# Altium project _autosave-untitled.PrjPcb
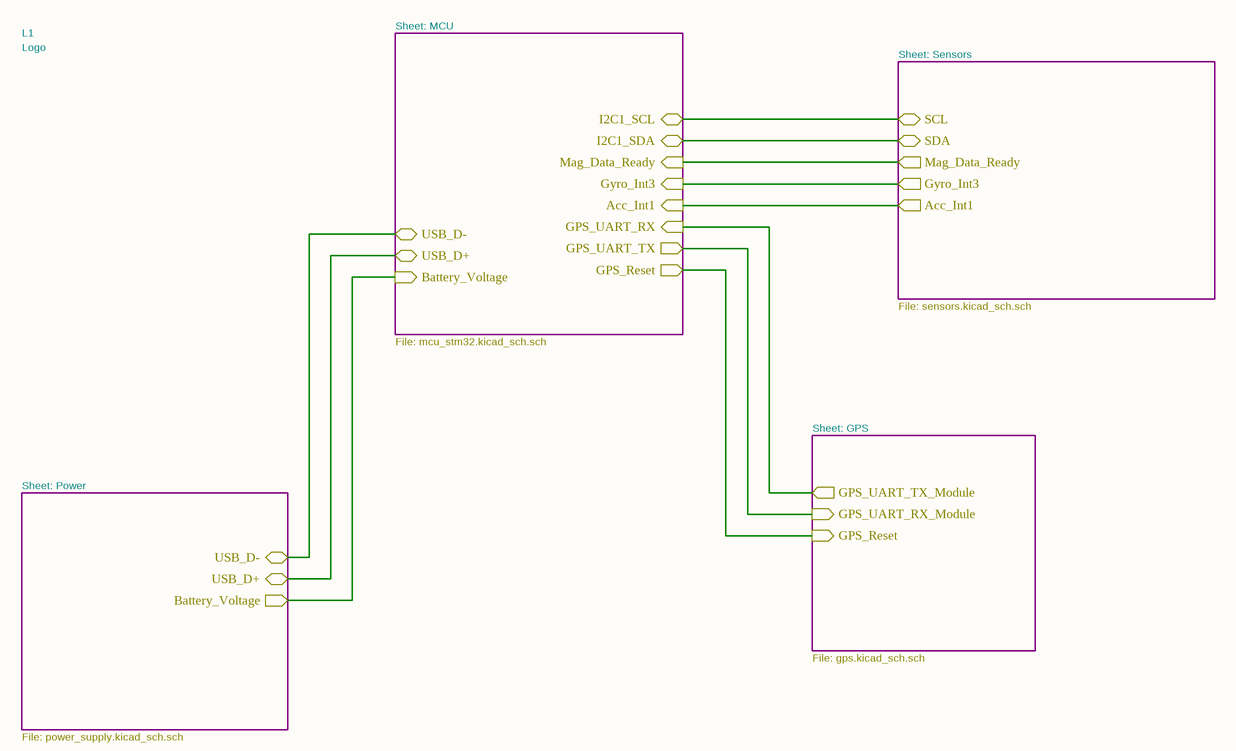
[diagram p0: circuit board design v2.1.SchDoc]
8 sheets, 72 parts. Net scope: hierarchical (ports join the sheet entries above them; power ports are global).
Board files: circuit board design v2.1.PcbDoc, circuit board design v2.1(1).PcbDoc
Sheets:
  _autosave-untitled.SchDoc
  circuit board design v2.1.SchDoc
    Sensors = sensors.SchDoc
    Power = power_supply.SchDoc
    GPS = gps.SchDoc
    MCU = mcu_stm32.SchDoc
  gps_ublox.SchDoc
  imu.SchDoc

## Sheet _autosave-untitled.SchDoc
size 297 x 209 mm

### Notes on the sheet
- 1
- 2
- 3
- 4
- 5
- 6
- A
- B
- C
- D
- Title:
- File: _autosave-untitled.kicad_sch
- Sheet: /
- KiCad E.D.A.  kicad (5.1.4)-1
- Size: A4
- Date:
- Rev:
- Id: 1/1

## Sheet circuit board design v2.1.SchDoc
size 297 x 209 mm

### Parts
L1  Logo  [ICSS_Logo]

### Sub-sheets
GPS = gps.SchDoc: GPS_Reset (in), GPS_UART_TX_Module (out), GPS_UART_RX_Module (in)
MCU = mcu_stm32.SchDoc: Battery_Voltage (in), GPS_UART_RX (in), GPS_UART_TX (out), GPS_Reset (out), USB_D- (bidir), USB_D+ (bidir), I2C1_SDA (bidir), I2C1_SCL (bidir), Acc_Int1 (in), Gyro_Int3 (in), Mag_Data_Ready (in)
Power = power_supply.SchDoc: Battery_Voltage (out), USB_D+ (bidir), USB_D- (bidir)
Sensors = sensors.SchDoc: SCL (bidir), SDA (bidir), Mag_Data_Ready (out), Acc_Int1 (out), Gyro_Int3 (out)

### Nets
Acc_Int1: sheet Sensors/Acc_Int1, sheet MCU/Acc_Int1
Battery_Voltage: sheet Power/Battery_Voltage, sheet MCU/Battery_Voltage
GPS_Reset: sheet GPS/GPS_Reset, sheet MCU/GPS_Reset
GPS_UART_RX: sheet GPS/GPS_UART_TX_Module, sheet MCU/GPS_UART_RX
GPS_UART_RX_Module: sheet GPS/GPS_UART_RX_Module, sheet MCU/GPS_UART_TX
Gyro_Int3: sheet Sensors/Gyro_Int3, sheet MCU/Gyro_Int3
I2C1_SCL: sheet Sensors/SCL, sheet MCU/I2C1_SCL
I2C1_SDA: sheet Sensors/SDA, sheet MCU/I2C1_SDA
Mag_Data_Ready: sheet Sensors/Mag_Data_Ready, sheet MCU/Mag_Data_Ready
USB_D+: sheet Power/USB_D+, sheet MCU/USB_D+
USB_D-: sheet Power/USB_D-, sheet MCU/USB_D-

### Notes on the sheet
- Sheet: MCU
- Sheet: Sensors
- File: mcu_stm32.kicad_sch.sch
- File: sensors.kicad_sch.sch
- Sheet: Power
- Sheet: GPS
- File: gps.kicad_sch.sch
- File: power_supply.kicad_sch.sch
- 1
- 2
- 3
- 4
- 5
- 6
- A
- B
- C
- D
- Title:
- File: circuit board design v2.1.kicad_sch
- Sheet: /
- KiCad E.D.A.  kicad (5.1.4)-1
- Size: A4
- Date:
- Rev:
- Id: 1/1

### Library data of the parts
L1 = Logo: Value: Logo; Footprint: Components:ICSS_Logo

## Sheet sensors.SchDoc
size 297 x 209 mm
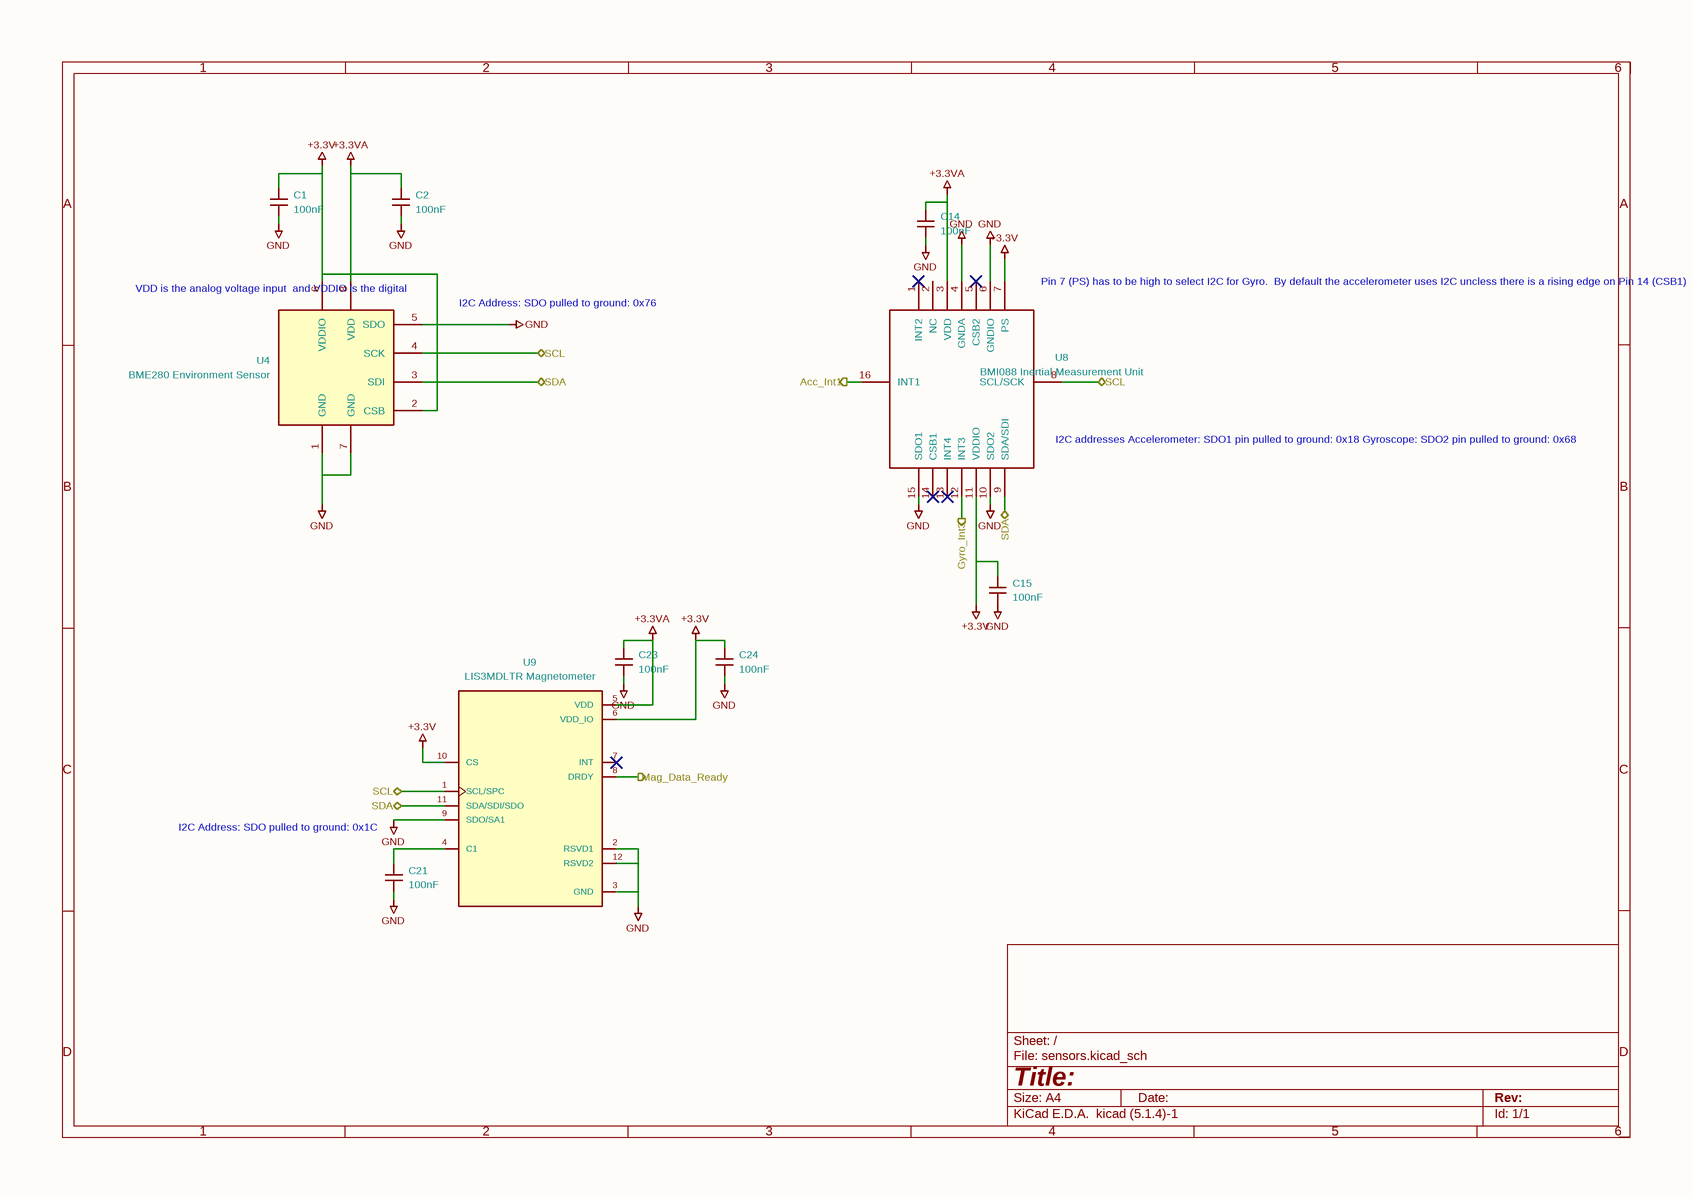
[diagram p1: sensors.SchDoc]

### Parts
C1  100nF  [C_0603_1608Metric]
C2  100nF  [C_0603_1608Metric]
C14  100nF  [C_0603_1608Metric]
C15  100nF  [C_0603_1608Metric]
C21  100nF  [C_0603_1608Metric]
C23  100nF  [C_0603_1608Metric]
C24  100nF  [C_0603_1608Metric]
U4  BME280 Environment Sensor  [Bosch_LGA-8_2.5x2.5mm_P0.65mm_ClockwisePinNumbering]
U8  BMI088 Inertial Measurement Unit  [BMI088]
U9  LIS3MDLTR Magnetometer  [XDCR_LIS3MDLTR]

### Ports
Acc_Int1 (out), Gyro_Int3 (out), Mag_Data_Ready (out), SCL (bidir), SDA (bidir)

### Nets
+3.3V: C1.1 C15.1 C24.1 U4.2(CSB) U4.6(VDDIO) U8.7(PS) U8.11(VDDIO) U9.6(VDD_IO) U9.10(CS)
+3.3VA: C2.1 C14.1 C23.1 U4.8(VDD) U8.3(VDD) U9.5(VDD)
GND: C1.2 C2.2 C14.2 C15.2 C21.2 C23.2 C24.2 U4.1(GND) U4.5(SDO) U4.7(GND) U8.4(GNDA) U8.6(GNDIO) U8.10(SDO2) U8.15(SDO1) U9.2(RSVD1) U9.3(GND) U9.9(SDO/SA1) U9.12(RSVD2)
Acc_Int1: U8.16(INT1) ; port Acc_Int1
Gyro_Int3: U8.12(INT3) ; port Gyro_Int3
I2C1_SCL: U4.4(SCK) U8.8(SCL/SCK) U9.1(SCL/SPC) ; port SCL
I2C1_SDA: U4.3(SDI) U8.9(SDA/SDI) U9.11(SDA/SDI/SDO) ; port SDA
Mag_Data_Ready: U9.8(DRDY) ; port Mag_Data_Ready
NetC21_1: C21.1 U9.4(C1)

Not connected (* = marked no-connect by the designer): U8 1(INT2)* 2(NC) 5(CSB2)* 13(INT4)* 14(CSB1)*; U9 7(INT)*

### Notes on the sheet
- (near U8) Pin 7 (PS) has to be high to select I2C for Gyro.
  By default the accelerometer uses I2C uncless there is a rising edge on Pin 14 (CSB1)
- (near U4) VDD is the analog voltage input
  and VDDIO is the digital
- I2C Address:
  SDO pulled to ground: 0x76
- (near U8) I2C addresses
  Accelerometer: SDO1 pin pulled to ground: 0x18
  Gyroscope: SDO2 pin pulled to ground: 0x68
- (near C21) I2C Address:
  SDO pulled to ground: 0x1C
- 1
- 2
- 3
- 4
- 5
- 6
- A
- B
- C
- D
- Title:
- File: sensors.kicad_sch
- Sheet: /
- KiCad E.D.A.  kicad (5.1.4)-1
- Size: A4
- Date:
- Rev:
- Id: 1/1

### Library data of the parts
C1 C2 C14 C15 C21 C23 C24 = C_0603: Value: 100nF; Footprint: Components:C_0603_1608Metric
U4 = BME280: Value: BME280 Environment Sensor; Footprint: Package_LGA:Bosch_LGA-8_2.5x2.5mm_P0.65mm_ClockwisePinNumbering
U8 = BMI088: Manufacturer_Name: BOSCH; Description: Inertial Measurement Unit Digital Output 2.5V/3.3V Automotive; Height: 1.45; Manufacturer_Part_Number: BMI088; Mouser Part Number: 262-BMI088; Mouser Price/Stock: https://www.mouser.co.uk/ProductDetail/Bosch-Sensortec/BMI088?qs=f9yNj16SXrIMFspTV6RB6Q%3D%3D; Arrow Part Number: BMI088; Arrow Price/Stock: https://www.arrow.com/en/products/bmi088/bosch?region=europe; Value: BMI088 Inertial Measurement Unit; Footprint: Components:BMI088
U9 = LIS3MDLTR: MF: STMicroelectronics; DESCRIPTION: LIS3MDL Series 3 Axis ±2/±8/±12/±16 g 3.6V High Performance Magnetometer LGA-12; PRICE: None; STANDARD: Manufacturer Recommendation; PARTREV: 6; MP: LIS3MDLTR; PACKAGE: VFLGA-12 STMicroelectronics; AVAILABILITY: Unavailable; MAXIMUM_PACKAGE_HEIGHT: 1mm; Value: LIS3MDLTR Magnetometer; Footprint: Components:XDCR_LIS3MDLTR

## Sheet power_supply.SchDoc
size 297 x 209 mm
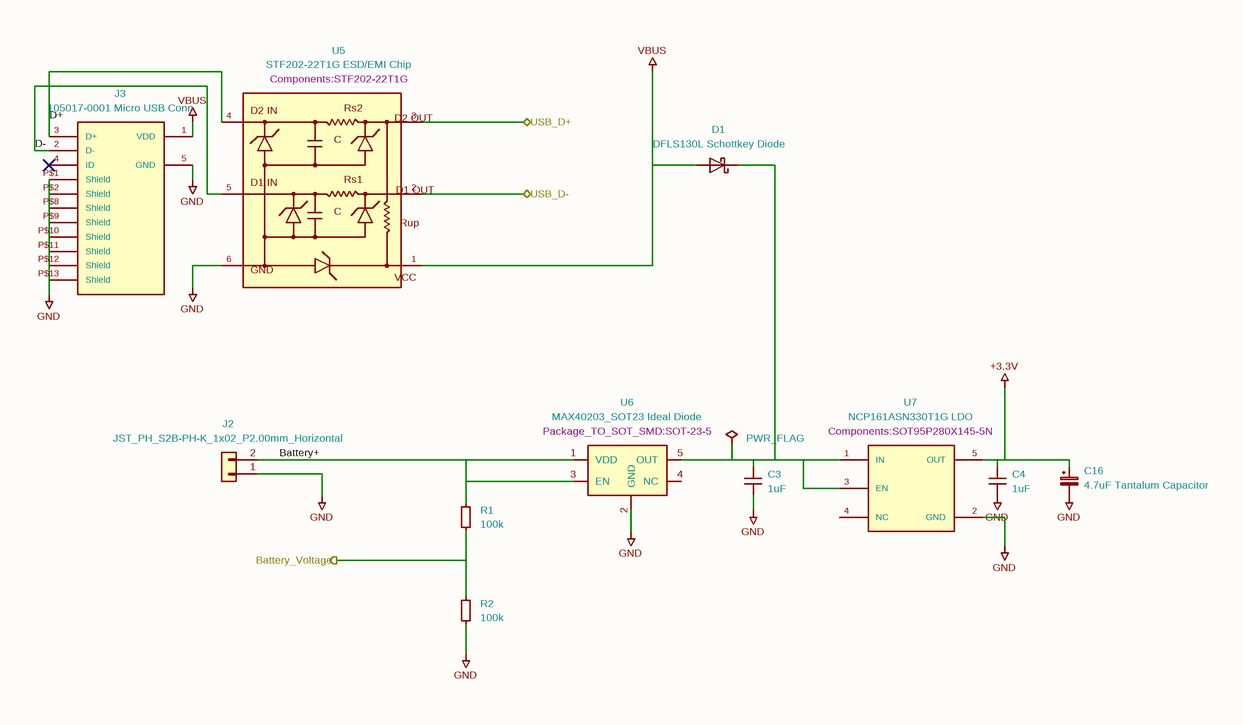
[diagram p2: power_supply.SchDoc]

### Parts
(Parts that share a designator on the sheet are numbered #1, #2 ... from top to bottom, then left to right.)
#FLG0102  PWR_FLAG  (graphical)
C3  1uF  [C_0603_1608Metric]
C4  1uF  [C_0603_1608Metric]
C16  4.7uF Tantalum Capacitor  [C_1206_3216Metric_Pad1.33x1.80mm_HandSolder]
D1  DFLS130L Schottkey Diode  [PowerDI123]
J2  JST_PH_S2B-PH-K_1x02_P2.00mm_Horizontal  [JST_PH_S2B-PH-K_1x02_P2.00mm_Horizontal]
J3  105017-0001 Micro USB Conn  [MOLEX_105017-0001]
R1  100k  [R_0603_1608Metric]
R2#1  100k  [R_0603_1608Metric]
U5  Footprint: Components:STF202-22T1G  [STF202-22T1G]  (hidden comment: STF202-22T1G ESD/EMI Chip)
U6  Footprint: Package_TO_SOT_SMD:SOT-23-5  [SOT-23-5]  (hidden comment: MAX40203_SOT23 Ideal Diode)
U7  Footprint: Components:SOT95P280X145-5N  [SOT95P280X145-5N]  (hidden comment: NCP161ASN330T1G LDO)

### Ports
Battery_Voltage (out), USB_D+ (bidir), USB_D- (bidir)

### Nets
+3.3V: C4.1 C16.1 U7.5(OUT)
GND: C3.2 C4.2 C16.2 J2.1(Pin_1) J3.5(GND) J3.P$1(Shield) J3.P$2(Shield) J3.P$8(Shield) J3.P$9(Shield) J3.P$10(Shield) J3.P$11(Shield) J3.P$12(Shield) J3.P$13(Shield) R2#1.2 U5.6 U6.2(GND) U7.2(GND)
VBUS: D1.2(A) J3.1(VDD) U5.1
Battery+: J2.2(Pin_2) R1.1 U6.1(VDD) U6.3(EN)
Battery_Voltage: R1.2 R2#1.1 ; port Battery_Voltage
D+: J3.3(D+) U5.4
D-: J3.2(D-) U5.5
USB_D+: U5.3 ; port USB_D+
USB_D-: U5.2 ; port USB_D-
Net#FLG0102_1: #FLG0102.1(pwr) C3.1 D1.1(K) U6.5(OUT) U7.1(IN) U7.3(EN)

Not connected (* = marked no-connect by the designer): J3 4(ID)*; U6 4(NC); U7 4(NC)

### Notes on the sheet
- 1
- 2
- 3
- 4
- 5
- 6
- A
- B
- C
- D
- Title:
- File: power_supply.kicad_sch
- Sheet: /
- KiCad E.D.A.  kicad (5.1.4)-1
- Size: A4
- Date:
- Rev:
- Id: 1/1
- (in symbol STF202-22T1G) D2 IN; Rs2; D2 OUT; C; D1 IN; Rs1; D1 OUT; Rup; GND; VCC

### Library data of the parts
C3 C4 = C_0603: Value: 1uF; Footprint: Components:C_0603_1608Metric
C16 = C_Polarized_Small: Value: 4.7uF Tantalum Capacitor; Footprint: Capacitor_SMD:C_1206_3216Metric_Pad1.33x1.80mm_HandSolder
D1 = DFLS130L: Value: DFLS130L Schottkey Diode; Footprint: Components:PowerDI123
J2 = Conn_01x02: Value: JST_PH_S2B-PH-K_1x02_P2.00mm_Horizontal; Footprint: Components:JST_PH_S2B-PH-K_1x02_P2.00mm_Horizontal
J3 = 105017-0001: Value: 105017-0001 Micro USB Conn
R1 R2#1 = R_0603: Value: 100k; Footprint: Components:R_0603_1608Metric
U5 = STF202-22T1G: Value: STF202-22T1G ESD/EMI Chip
U6 = MAX40203_SOT23: Value: MAX40203_SOT23 Ideal Diode
U7 = NCP161ASN180T1G: MANUFACTURER: Onsemi; PARTREV: Rev. 18; SNAPEDA_PN: NCP161ASN180T1G; STANDARD: IPC-7351B; MAXIMUM_PACKAGE_HEIGHT: 1.45 mm; Value: NCP161ASN330T1G LDO
#FLG0102 = PWR_FLAG: Value: PWR_FLAG

## Sheet gps.SchDoc
size 297 x 209 mm
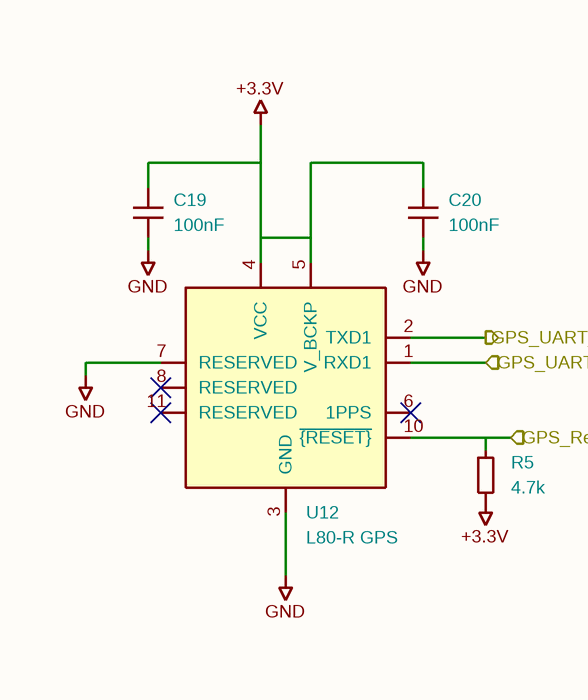
[diagram p3: gps.SchDoc]

### Parts
C19  100nF  [C_0603_1608Metric]
C20  100nF  [C_0603_1608Metric]
R5  4.7k  [R_0603_1608Metric]
U12  L80-R GPS  [Quectel_L80-R]

### Ports
GPS_Reset (in), GPS_UART_RX_Module (in), GPS_UART_TX_Module (out)

### Nets
+3.3V: C19.1 C20.1 R5.2 U12.4(VCC) U12.5(V_BCKP)
GND: C19.2 C20.2 U12.3(GND) U12.7(RESERVED)
GPS_Reset: R5.1 U12.10(~{{RESET}}) ; port GPS_Reset
GPS_UART_RX: U12.2(TXD1) ; port GPS_UART_TX_Module
GPS_UART_RX_Module: U12.1(RXD1) ; port GPS_UART_RX_Module

Not connected (* = marked no-connect by the designer): U12 6(1PPS)* 8(RESERVED)* 9(NC) 11(RESERVED)* 12(GND)

### Notes on the sheet
- 1
- 2
- 3
- 4
- 5
- 6
- A
- B
- C
- D
- Title:
- File: gps.kicad_sch
- Sheet: /
- KiCad E.D.A.  kicad (5.1.4)-1
- Size: A4
- Date:
- Rev:
- Id: 1/1

### Library data of the parts
C19 C20 = C_0603: Value: 100nF; Footprint: Components:C_0603_1608Metric
R5 = R_0603: Value: 4.7k; Footprint: Components:R_0603_1608Metric
U12 = L80-R: Value: L80-R GPS; Footprint: Components:Quectel_L80-R

## Sheet mcu_stm32.SchDoc
size 297 x 209 mm
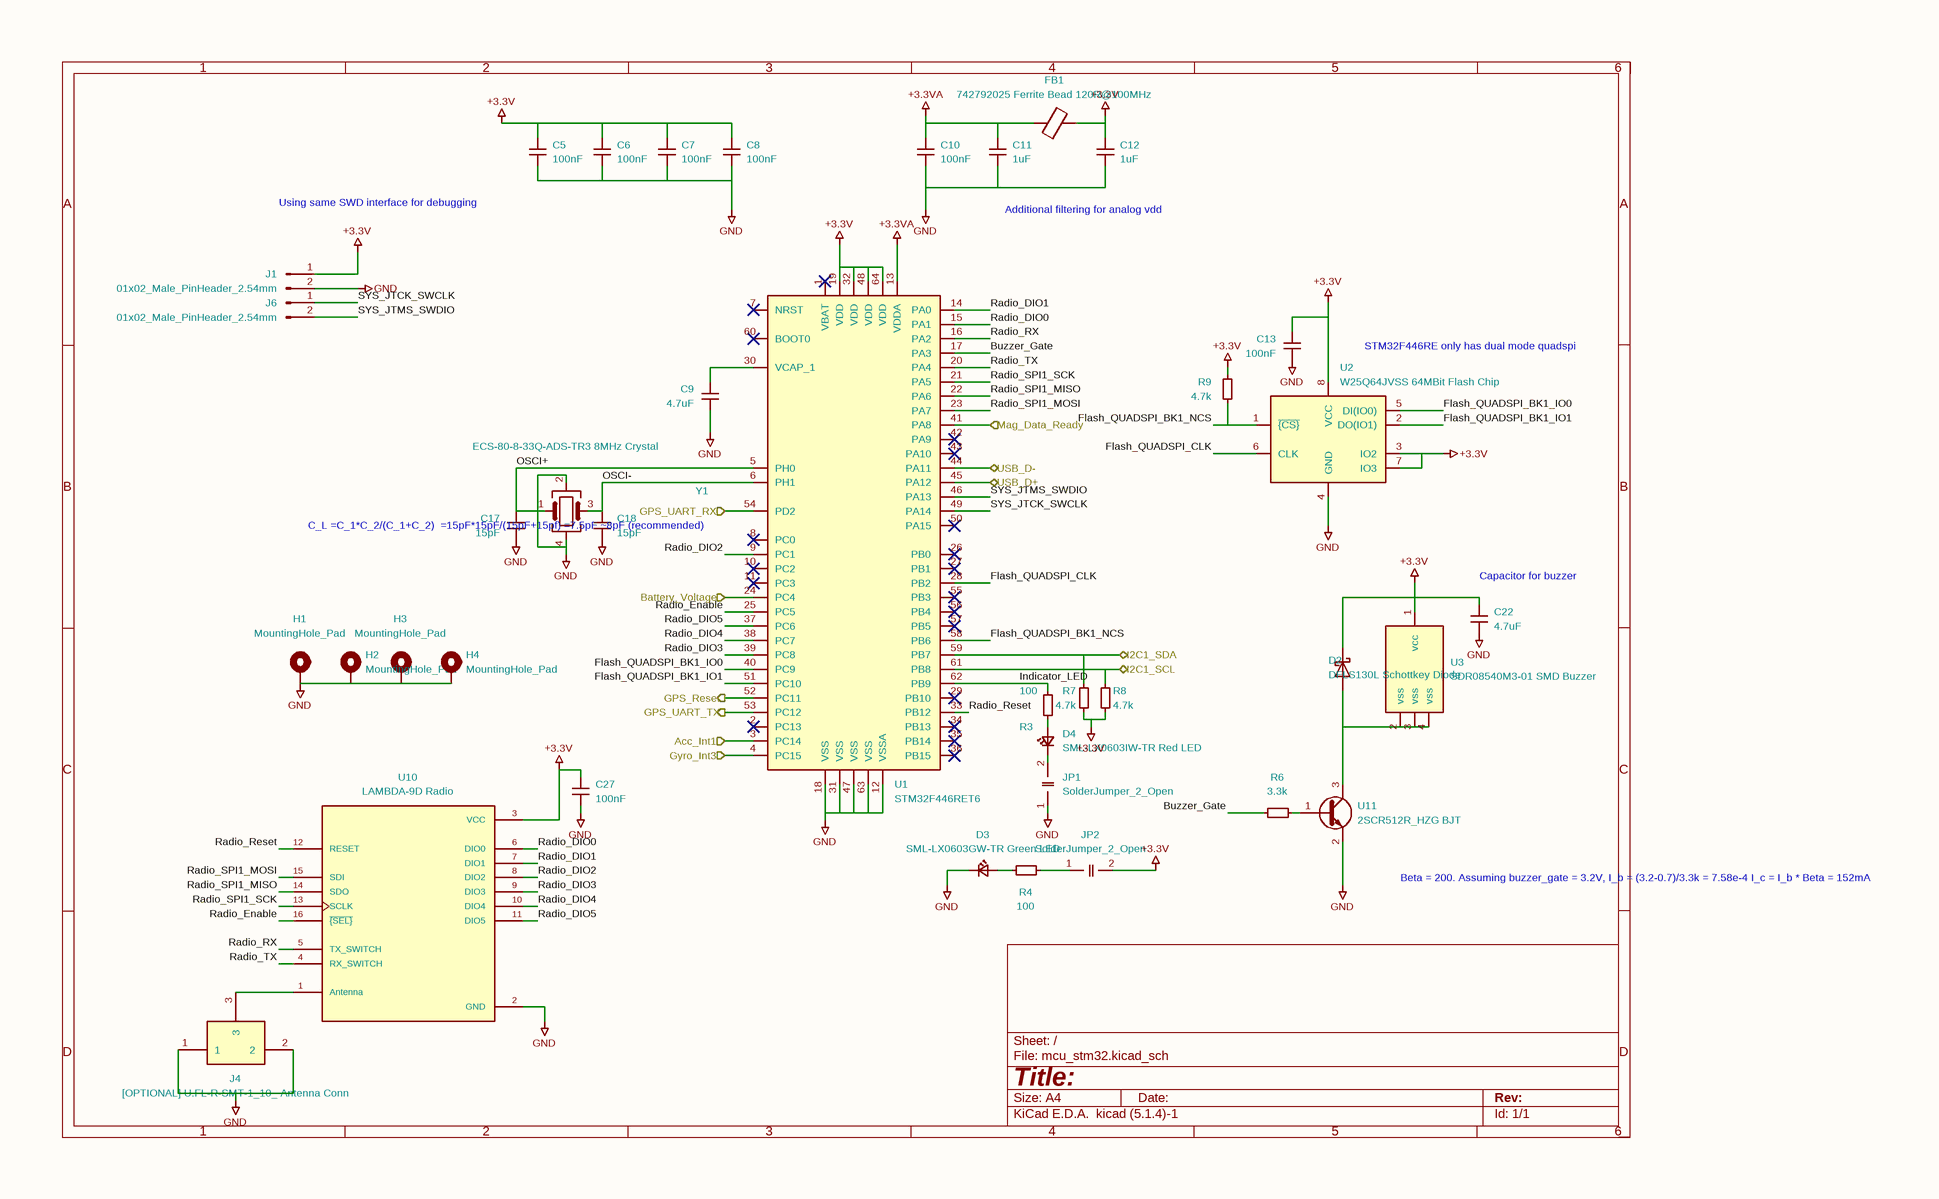
[diagram p4: mcu_stm32.SchDoc]

### Parts
(Parts that share a designator on the sheet are numbered #1, #2 ... from top to bottom, then left to right.)
C5  100nF  [C_0603_1608Metric]
C6  100nF  [C_0603_1608Metric]
C7  100nF  [C_0603_1608Metric]
C8#1  100nF  [C_0603_1608Metric]
C9  4.7uF  [C_0603_1608Metric]
C10  100nF  [C_0603_1608Metric]
C11#1  1uF  [C_0603_1608Metric]
C12#1  1uF  [C_0603_1608Metric]
C13  100nF  [C_0603_1608Metric]
C17  15pF  [C_0603_1608Metric]
C18  15pF  [C_0603_1608Metric]
C22  4.7uF  [C_0603_1608Metric]
C27  100nF  [C_0603_1608Metric_Pad1.08x0.95mm_HandSolder]
D2  DFLS130L Schottkey Diode  [PowerDI123]
D3  SML-LX0603GW-TR Green LED  [C_0603_1608Metric]
D4  SML-LX0603IW-TR Red LED  [C_0603_1608Metric]
FB1  742792025 Ferrite Bead 120R@100MHz  [R_0805_2012Metric_Pad1.20x1.40mm_HandSolder]
H1  MountingHole_Pad  [MountingHole_3.2mm_M3_ISO7380_Pad_TopBottom]
H2  MountingHole_Pad  [MountingHole_3.2mm_M3_ISO7380_Pad_TopBottom]
H3  MountingHole_Pad  [MountingHole_3.2mm_M3_ISO7380_Pad_TopBottom]
H4  MountingHole_Pad  [MountingHole_3.2mm_M3_ISO7380_Pad_TopBottom]
J1#1  01x02_Male_PinHeader_2.54mm  [PinHeader_1x02_P2.54mm_Vertical]
J4  [OPTIONAL] U.FL-R-SMT-1_10_ Antenna Conn  [U.FL-R-SMT-1_10_]
J6  01x02_Male_PinHeader_2.54mm  [PinHeader_1x02_P2.54mm_Vertical]
JP1  SolderJumper_2_Open  [SolderJumper-2_P1.3mm_Open_TrianglePad1.0x1.5mm]
JP2  SolderJumper_2_Open  [SolderJumper-2_P1.3mm_Open_TrianglePad1.0x1.5mm]
R3  100  [R_0603_1608Metric]
R4  100  [R_0603_1608Metric]
R6  3.3k  [R_0603_1608Metric]
R7  4.7k  [R_0603_1608Metric]
R8  4.7k  [R_0603_1608Metric]
R9  4.7k  [R_0603_1608Metric]
U1  STM32F446RET6  [LQFP-64_10x10mm_P0.5mm]
U2#1  W25Q64JVSS 64MBit Flash Chip  [W25Q64JVSSIQ]
U3  SDR08540M3-01 SMD Buzzer  [SDR08540M3-01 Buzzer]
U10  LAMBDA-9D Radio  [XCVR_LAMBDA-9D]
U11  2SCR512R_HZG BJT  [2SCR512RHZG]
Y1  ECS-80-8-33Q-ADS-TR3 8MHz Crystal  [ECS-80-8-33Q-ADS-TR3 Crystal]

### Ports
Acc_Int1 (in), Battery_Voltage (in), GPS_Reset (out), GPS_UART_RX (in), GPS_UART_TX (out), Gyro_Int3 (in), I2C1_SCL (bidir), I2C1_SDA (bidir), Mag_Data_Ready (in), USB_D+ (bidir), USB_D- (bidir)

### Nets
+3.3V: C5.1 C6.1 C7.1 C8#1.1 C12#1.1 C13.1 C22.1 C27.1 D2.1(K) FB1.2 J1#1.1(Pin_1) JP2.2(B) R7.2 R8.2 R9.1 U1.19(VDD) U1.32(VDD) U1.48(VDD) U1.64(VDD) U2#1.3(IO2) U2#1.7(IO3) U2#1.8(VCC) U3.1(vcc) U10.3(VCC)
+3.3VA: C10.1 C11#1.1 FB1.1 U1.13(VDDA)
GND: C5.2 C6.2 C7.2 C8#1.2 C9.2 C10.2 C11#1.2 C12#1.2 C13.2 C17.2 C18.2 C22.2 C27.2 D3.1(K) H1.1 H2.1 H3.1 H4.1 J1#1.2(Pin_2) J4.1 J4.2 JP1.1(A) U1.12(VSSA) U1.18(VSS) U1.31(VSS) U1.47(VSS) U1.63(VSS) U2#1.4(GND) U10.2(GND) U11.2(E) Y1.2 Y1.4
Acc_Int1: U1.3(PC14) ; port Acc_Int1
Battery_Voltage: U1.24(PC4) ; port Battery_Voltage
Buzzer_Gate: R6.1 U1.17(PA3)
Flash_QUADSPI_BK1_IO0: U1.40(PC9) U2#1.5(DI(IO0))
Flash_QUADSPI_BK1_IO1: U1.51(PC10) U2#1.2(DO(IO1))
Flash_QUADSPI_BK1_NCS: R9.2 U1.58(PB6) U2#1.1(~{{CS}})
Flash_QUADSPI_CLK: U1.28(PB2) U2#1.6(CLK)
GPS_Reset: U1.52(PC11) ; port GPS_Reset
GPS_UART_RX: U1.54(PD2) ; port GPS_UART_RX
GPS_UART_RX_Module: U1.53(PC12) ; port GPS_UART_TX
Gyro_Int3: U1.4(PC15) ; port Gyro_Int3
I2C1_SCL: R8.1 U1.61(PB8) ; port I2C1_SCL
I2C1_SDA: R7.1 U1.59(PB7) ; port I2C1_SDA
Indicator_LED: R3.1 U1.62(PB9)
Mag_Data_Ready: U1.41(PA8) ; port Mag_Data_Ready
OSCI+: C17.1 U1.5(PH0) Y1.1
OSCI-: C18.1 U1.6(PH1) Y1.3
Radio_DIO0: U1.15(PA1) U10.6(DIO0)
Radio_DIO1: U1.14(PA0) U10.7(DIO1)
Radio_DIO2: U1.9(PC1) U10.8(DIO2)
Radio_DIO3: U1.39(PC8) U10.9(DIO3)
Radio_DIO4: U1.38(PC7) U10.10(DIO4)
Radio_DIO5: U1.37(PC6) U10.11(DIO5)
Radio_Enable: U1.25(PC5) U10.16(~{{SEL}})
Radio_Reset: U1.33(PB12) U10.12(RESET)
Radio_RX: U1.16(PA2) U10.5(TX_SWITCH)
Radio_SPI1_MISO: U1.22(PA6) U10.14(SDO)
Radio_SPI1_MOSI: U1.23(PA7) U10.15(SDI)
Radio_SPI1_SCK: U1.21(PA5) U10.13(SCLK)
Radio_TX: U1.20(PA4) U10.4(RX_SWITCH)
SYS_JTCK_SWCLK: J6.1(Pin_1) U1.49(PA14)
SYS_JTMS_SWDIO: J6.2(Pin_2) U1.46(PA13)
USB_D+: U1.45(PA12) ; port USB_D+
USB_D-: U1.44(PA11) ; port USB_D-
NetC9_1: C9.1 U1.30(VCAP_1)
NetD2_2: D2.2(A) U3.2(vss) U3.3(vss) U3.4(vss) U11.3(C)
NetD3_2: D3.2(A) R4.1
NetD4_1: D4.1(K) JP1.2(B)
NetD4_2: D4.2(A) R3.2
NetJ4_3: J4.3 U10.1(Antenna)
NetJP2_1: JP2.1(A) R4.2
NetR6_2: R6.2 U11.1(B)

Not connected (* = marked no-connect by the designer): U1 1(VBAT)* 2(PC13)* 7(NRST)* 8(PC0)* 10(PC2)* 11(PC3)* 26(PB0)* 27(PB1)* 29(PB10)* 34(PB13)* 35(PB14)* 36(PB15)* 42(PA9)* 43(PA10)* 50(PA15)* 55(PB3)* 56(PB4)* 57(PB5)* 60(BOOT0)*

### Notes on the sheet
- Using same SWD interface for debugging
- Additional filtering for analog vdd
- (near U2#1) STM32F446RE only has dual mode quadspi
- C_L
  =C_1*C_2/(C_1+C_2)
  =15pF*15pF/(15pF+15pf)
  =7.5pF ~8pF (recommended)
- (near C22) Capacitor for buzzer
- Beta = 200.
  Assuming buzzer_gate = 3.2V,
  I_b = (3.2-0.7)/3.3k = 7.58e-4
  I_c = I_b * Beta = 152mA
- 1
- 2
- 3
- 4
- 5
- 6
- A
- B
- C
- D
- Title:
- File: mcu_stm32.kicad_sch
- Sheet: /
- KiCad E.D.A.  kicad (5.1.4)-1
- Size: A4
- Date:
- Rev:
- Id: 1/1

### Library data of the parts
C5-C7 C8#1 C9 C10 C11#1 C12#1 C13 C17 C18 C22 = C_0603: Footprint: Components:C_0603_1608Metric
  C5-C7 C8#1 C10 C13: Value: 100nF
  C9 C22: Value: 4.7uF
  C11#1 C12#1: Value: 1uF
  C17 C18: Value: 15pF
C27 = C_Small: Value: 100nF; Footprint: Capacitor_SMD:C_0603_1608Metric_Pad1.08x0.95mm_HandSolder
D2 = DFLS130L: Value: DFLS130L Schottkey Diode; Footprint: Components:PowerDI123
D3 D4 = LED_0603: Footprint: Components:C_0603_1608Metric
  D3: Value: SML-LX0603GW-TR Green LED
  D4: Value: SML-LX0603IW-TR Red LED
FB1 = FerriteBead: Value: 742792025 Ferrite Bead 120R@100MHz; Footprint: Resistor_SMD:R_0805_2012Metric_Pad1.20x1.40mm_HandSolder
J1#1 J6 = Conn_01x02_Male: Value: 01x02_Male_PinHeader_2.54mm; Footprint: Connector_PinHeader_2.54mm:PinHeader_1x02_P2.54mm_Vertical
J4 = U.FL-R-SMT-1_10_: Manufacturer_Name: Hirose; Manufacturer_Part_Number: U.FL-R-SMT-1(10); Mouser Part Number: 798-U.FL-R-SMT-110; Mouser Price/Stock: https://www.mouser.co.uk/ProductDetail/Hirose-Connector/U.FL-R-SMT-110?qs=kL1ClTr6oBoOdtqlGQpQrQ%3D%3D; Arrow Part Number: U.FL-R-SMT-1(10); Arrow Price/Stock: https://www.arrow.com/en/products/u.fl-r-smt-1-10/hirose-electric; Value: [OPTIONAL] U.FL-R-SMT-1_10_ Antenna Conn; Footprint: Components:U.FL-R-SMT-1_10_
R3 R4 R6-R9 = R_0603: Footprint: Components:R_0603_1608Metric
  R3 R4: Value: 100
  R6: Value: 3.3k
  R7-R9: Value: 4.7k
U1 = STM32F446RETx: Value: STM32F446RET6; Footprint: Components:LQFP-64_10x10mm_P0.5mm
U2#1 = W25Q64JVSS: Value: W25Q64JVSS 64MBit Flash Chip; Footprint: Components:W25Q64JVSSIQ
U3 = SDR08540M3-01: Value: SDR08540M3-01 SMD Buzzer; Footprint: Components:SDR08540M3-01 Buzzer
U10 = LAMBDA-9D: MANUFACTURER: RF Solutions; SNAPEDA_PACKAGE_ID: 63698; MAXIMUM_PACKAGE_HEIGHT: 5.81 mm; STANDARD: Manufacturer Recommendations; PARTREV: N/A; SNAPEDA_PN: LAMBDA-9D; Value: LAMBDA-9D Radio; Footprint: Components:XCVR_LAMBDA-9D
U11 = 2SCR512R_HZG: Value: 2SCR512R_HZG BJT; Footprint: Components:2SCR512RHZG
Y1 = Crystal_GND24: Value: ECS-80-8-33Q-ADS-TR3 8MHz Crystal; Footprint: Components:ECS-80-8-33Q-ADS-TR3 Crystal
H1-H4 = MountingHole_Pad: Value: MountingHole_Pad; Footprint: MountingHole:MountingHole_3.2mm_M3_ISO7380_Pad_TopBottom
JP1 JP2 = SolderJumper_2_Open: Value: SolderJumper_2_Open; Footprint: Jumper:SolderJumper-2_P1.3mm_Open_TrianglePad1.0x1.5mm

## Sheet gps_ublox.SchDoc
size 297 x 209 mm
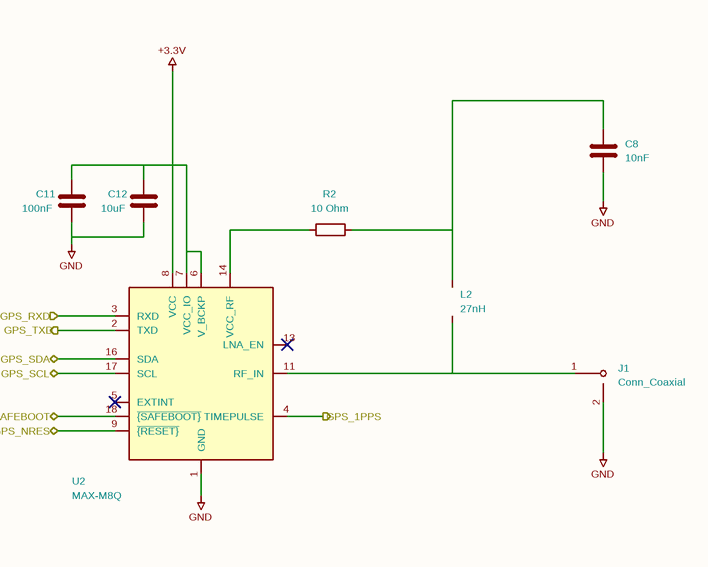
[diagram p5: gps_ublox.SchDoc]

### Parts
(Parts that share a designator on the sheet are numbered #1, #2 ... from top to bottom, then left to right.)
C8#2  10nF
C11#2  100nF
C12#2  10uF
J1#2  Conn_Coaxial
L2  27nH
R2#2  10 Ohm
U2#2  MAX-M8Q  [ublox_MAX]

### Ports
GPS_1PPS (out), GPS_NRES (bidir), GPS_NSAFEBOOT (bidir), GPS_RXD (in), GPS_SCL (bidir), GPS_SDA (bidir), GPS_TXD (out)

### Nets
+3.3V: C11#2.1 C12#2.1 U2#2.6(V_BCKP) U2#2.7(VCC_IO) U2#2.8(VCC)
GND: C8#2.2 C11#2.2 C12#2.2 J1#2.2(Ext) U2#2.1(GND)
GPS_1PPS: U2#2.4(TIMEPULSE) ; port GPS_1PPS
GPS_NRES: U2#2.9(~{{RESET}}) ; port GPS_NRES
GPS_NSAFEBOOT: U2#2.18(~{{SAFEBOOT}}) ; port GPS_NSAFEBOOT
GPS_RXD: U2#2.3(RXD) ; port GPS_RXD
GPS_SCL: U2#2.17(SCL) ; port GPS_SCL
GPS_SDA: U2#2.16(SDA) ; port GPS_SDA
GPS_TXD: U2#2.2(TXD) ; port GPS_TXD
NetC8#2_1: C8#2.1 L2.1 R2#2.2
NetJ1#2_1: J1#2.1(In) L2.2 U2#2.11(RF_IN)
NetR2#2_1: R2#2.1 U2#2.14(VCC_RF)

Not connected (* = marked no-connect by the designer): U2#2 5(EXTINT)* 10(GND) 12(GND) 13(LNA_EN)* 15(Reserved)

### Notes on the sheet
- 1
- 2
- 3
- 4
- 5
- 6
- A
- B
- C
- D
- Title:
- File: gps_ublox.kicad_sch
- Sheet: /
- KiCad E.D.A.  kicad (5.1.4)-1
- Size: A4
- Date:
- Rev:
- Id: 1/1

### Library data of the parts
C8#2 C11#2 C12#2 = C
  C8#2: Value: 10nF
  C11#2: Value: 100nF
  C12#2: Value: 10uF
L2 = L: Value: 27nH
R2#2 = R: Value: 10 Ohm
J1#2 = Conn_Coaxial: Value: Conn_Coaxial
U2#2 = MAX-M8Q: Value: MAX-M8Q; Footprint: RF_GPS:ublox_MAX

## Sheet imu.SchDoc
size 297 x 209 mm

### Notes on the sheet
- 1
- 2
- 3
- 4
- 5
- 6
- A
- B
- C
- D
- Title:
- File: imu.kicad_sch
- Sheet: /
- KiCad E.D.A.  kicad (5.1.4)-1
- Size: A4
- Date:
- Rev:
- Id: 1/1

## Nets that join several sheets
+3.3V: sensors (9 pins), power_supply (C4.1 C16.1 U7.5), gps (5 pins), mcu_stm32 (24 pins), gps_ublox (5 pins)
+3.3VA: sensors (6 pins), mcu_stm32 (C10.1 C11#1.1 FB1.1 U1.13)
GND: sensors (18 pins), power_supply (17 pins), gps (C19.2 C20.2 U12.3 U12.7), mcu_stm32 (32 pins), gps_ublox (5 pins)
Acc_Int1: sensors (U8.16), mcu_stm32 (U1.3)
Battery_Voltage: power_supply (R1.2 R2#1.1), mcu_stm32 (U1.24)
GPS_Reset: gps (R5.1 U12.10), mcu_stm32 (U1.52)
GPS_UART_RX: gps (U12.2), mcu_stm32 (U1.54)
GPS_UART_RX_Module: gps (U12.1), mcu_stm32 (U1.53)
Gyro_Int3: sensors (U8.12), mcu_stm32 (U1.4)
I2C1_SCL: sensors (U4.4 U8.8 U9.1), mcu_stm32 (R8.1 U1.61)
I2C1_SDA: sensors (U4.3 U8.9 U9.11), mcu_stm32 (R7.1 U1.59)
Mag_Data_Ready: sensors (U9.8), mcu_stm32 (U1.41)
USB_D+: power_supply (U5.3), mcu_stm32 (U1.45)
USB_D-: power_supply (U5.2), mcu_stm32 (U1.44)